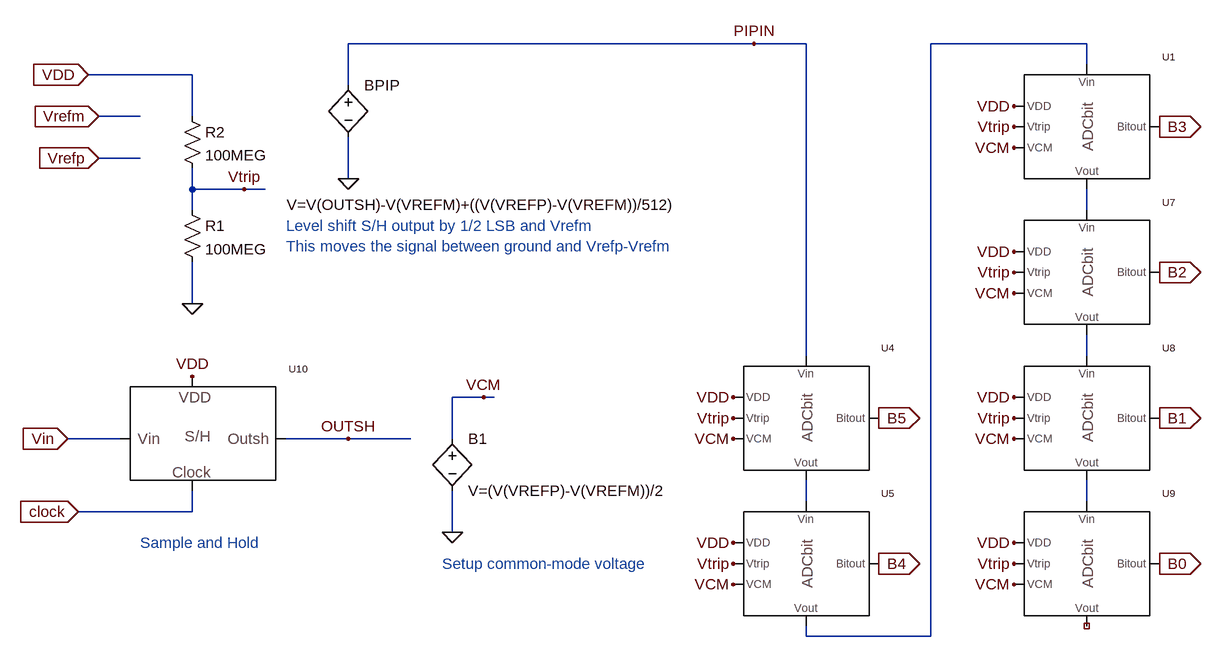
[diagram p0: schematic Ideal_6_bit_ADC.asc]
Ideal_6_bit_ADC.asc, the LTspice schematic file:
Version 4
SHEET 1 2740 696
WIRE 1296 -1104 672 -1104
WIRE 1376 -1104 1296 -1104
WIRE 1808 -1104 1568 -1104
WIRE 1808 -1072 1808 -1104
WIRE 432 -1056 272 -1056
WIRE 672 -1040 672 -1104
WIRE 352 -992 288 -992
WIRE 432 -992 432 -1056
WIRE 352 -928 288 -928
WIRE 672 -896 672 -960
WIRE 432 -880 432 -912
WIRE 512 -880 432 -880
WIRE 544 -880 512 -880
WIRE 432 -848 432 -880
WIRE 1808 -848 1808 -880
WIRE 432 -704 432 -768
WIRE 1376 -624 1376 -1104
WIRE 1808 -624 1808 -656
WIRE 880 -560 832 -560
WIRE 896 -560 880 -560
WIRE 320 -496 240 -496
WIRE 672 -496 576 -496
WIRE 768 -496 672 -496
WIRE 832 -496 832 -560
WIRE 1376 -400 1376 -432
WIRE 1808 -400 1808 -432
WIRE 432 -384 432 -416
WIRE 432 -384 256 -384
WIRE 832 -352 832 -416
WIRE 1376 -192 1376 -208
WIRE 1568 -192 1568 -1104
WIRE 1568 -192 1376 -192
FLAG 256 -384 clock
IOPIN 256 -384 In
FLAG 672 -496 OUTSH
FLAG 512 -880 Vtrip
FLAG 432 -704 0
FLAG 272 -1056 VDD
IOPIN 272 -1056 In
FLAG 240 -496 Vin
IOPIN 240 -496 In
FLAG 832 -352 0
FLAG 880 -560 VCM
FLAG 672 -896 0
FLAG 1264 -528 Vtrip
FLAG 1264 -560 VDD
FLAG 1264 -496 VCM
FLAG 1488 -528 B5
IOPIN 1488 -528 Out
FLAG 1264 -304 Vtrip
FLAG 1264 -336 VDD
FLAG 1264 -272 VCM
FLAG 1488 -304 B4
IOPIN 1488 -304 Out
FLAG 1696 -976 Vtrip
FLAG 1696 -1008 VDD
FLAG 1696 -944 VCM
FLAG 1920 -976 B3
IOPIN 1920 -976 Out
FLAG 1696 -752 Vtrip
FLAG 1696 -784 VDD
FLAG 1696 -720 VCM
FLAG 1920 -752 B2
IOPIN 1920 -752 Out
FLAG 1696 -528 Vtrip
FLAG 1696 -560 VDD
FLAG 1696 -496 VCM
FLAG 1920 -528 B1
IOPIN 1920 -528 Out
FLAG 1696 -304 Vtrip
FLAG 1696 -336 VDD
FLAG 1696 -272 VCM
FLAG 1920 -304 B0
IOPIN 1920 -304 Out
FLAG 1296 -1104 PIPIN
FLAG 288 -992 Vrefm
IOPIN 288 -992 In
FLAG 288 -928 Vrefp
IOPIN 288 -928 In
FLAG 432 -592 VDD
SYMBOL res 416 -864 R0
SYMATTR InstName R1
SYMATTR Value 100MEG
SYMBOL res 416 -1008 R0
SYMATTR InstName R2
SYMATTR Value 100MEG
SYMBOL bv 832 -512 R0
SYMATTR InstName B1
SYMATTR Value V=(V(VREFP)-V(VREFM))/2
SYMBOL bv 672 -1056 R0
WINDOW 3 -95 200 Left 0
SYMATTR Value V=V(OUTSH)-V(VREFM)+((V(VREFP)-V(VREFM))/512)
SYMATTR InstName BPIP
SYMBOL ADCbit 1232 -512 R0
SYMATTR InstName U4
SYMBOL ADCbit 1232 -288 R0
SYMATTR InstName U5
SYMBOL ADCbit 1664 -960 R0
SYMATTR InstName U1
SYMBOL ADCbit 1664 -736 R0
SYMATTR InstName U7
SYMBOL ADCbit 1664 -512 R0
SYMATTR InstName U8
SYMBOL ADCbit 1664 -288 R0
SYMATTR InstName U9
SYMBOL Sample_and_hold 336 -432 R0
SYMATTR InstName U10
TEXT 352 -336 Left 0 ;Sample and Hold
TEXT 576 -824 Left 0 ;Level shift S/H output by 1/2 LSB and Vrefm
TEXT 816 -304 Left 0 ;Setup common-mode voltage
TEXT 576 -792 Left 0 ;This moves the signal between ground and Vrefp-Vrefm

The netlist it stands for:
* Ideal_6_bit_ADC.asc
R1 Vtrip 0 100MEG
R2 VDD Vtrip 100MEG
B1 VCM 0 V=(V(VREFP)-V(VREFM))/2
BPIP PIPIN 0 V=V(OUTSH)-V(VREFM)+((V(VREFP)-V(VREFM))/512)
XU4 VDD Vtrip VCM PIPIN B5 N004 ADCbit  ; pins VDD Vtrip VCM Vin Bitout Vout
XU5 VDD Vtrip VCM N004 B4 N001 ADCbit  ; pins VDD Vtrip VCM Vin Bitout Vout
XU1 VDD Vtrip VCM N001 B3 N002 ADCbit  ; pins VDD Vtrip VCM Vin Bitout Vout
XU7 VDD Vtrip VCM N002 B2 N003 ADCbit  ; pins VDD Vtrip VCM Vin Bitout Vout
XU8 VDD Vtrip VCM N003 B1 N005 ADCbit  ; pins VDD Vtrip VCM Vin Bitout Vout
XU9 VDD Vtrip VCM N005 B0 NC_01 ADCbit  ; pins VDD Vtrip VCM Vin Bitout Vout
XU10 Vin OUTSH clock VDD Sample_and_hold  ; pins Vin Outsh Clock VDD
* Sample and Hold
* Level shift S/H output by 1/2 LSB and Vrefm
* Setup common-mode voltage
* This moves the signal between ground and Vrefp-Vrefm
.backanno
.end